# Altium schematic sheet FPGA Transcievers.SchDoc
size A3; SheetNumber: 6; SheetTotal: 16
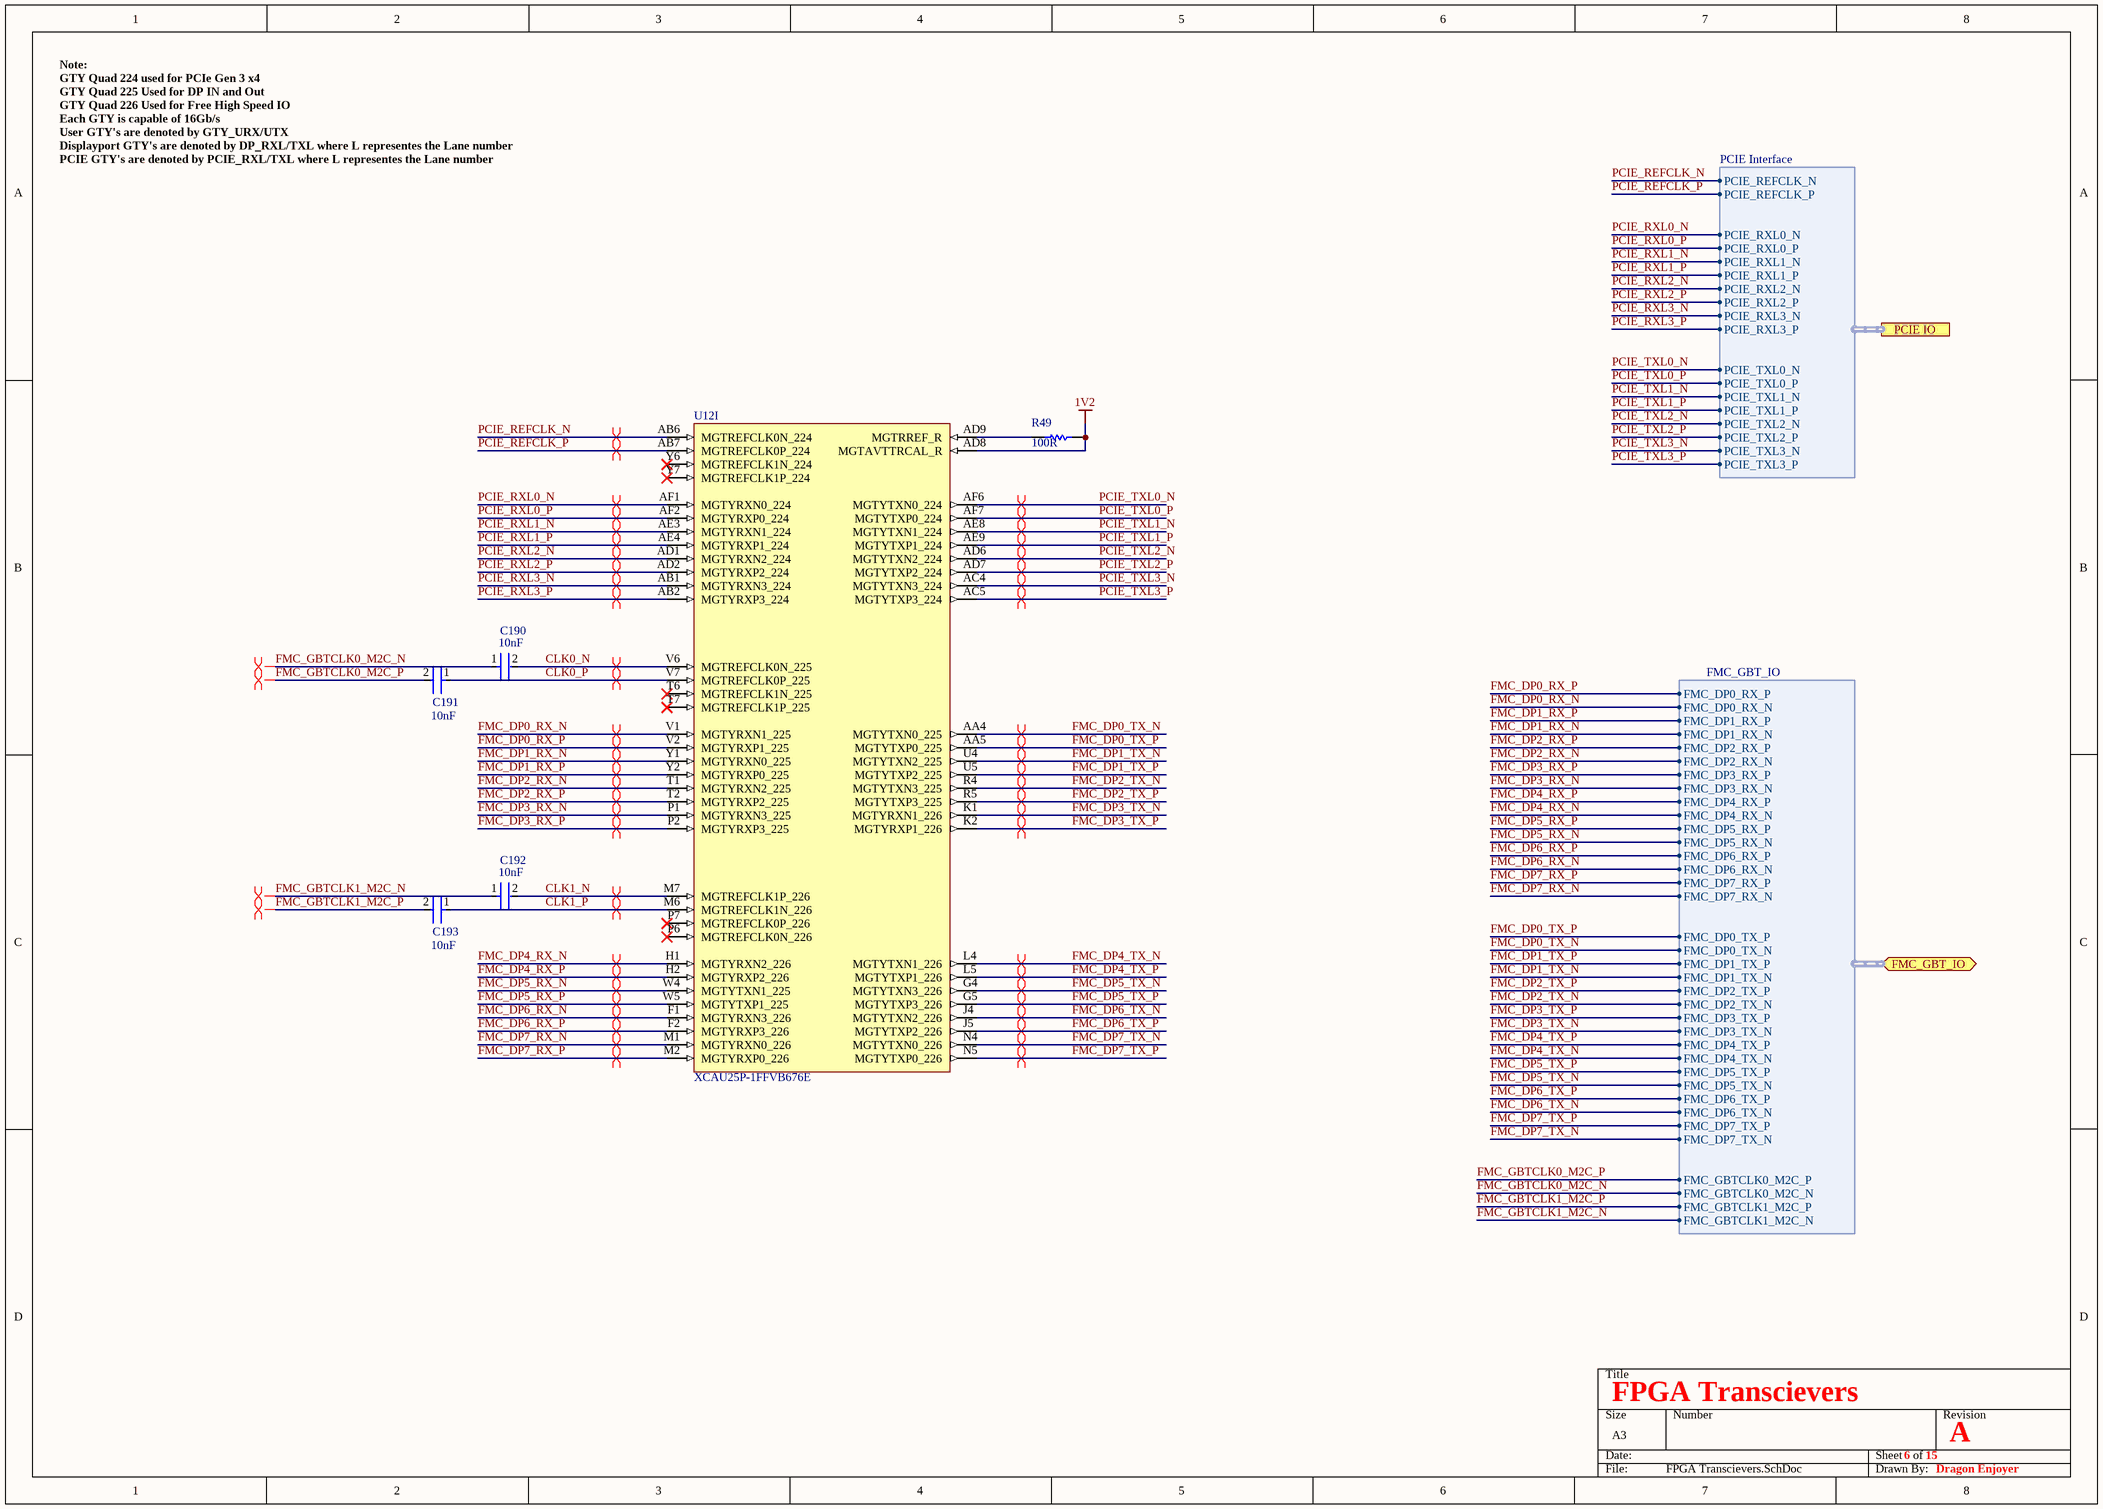
[diagram p0: FPGA Transcievers.SchDoc]

## Parts
C190  Capacitance: 10nF  [FP-GRM155-0_05-IPC_C]  (hidden comment: GRM155R71H103KA88D)
C191  Capacitance: 10nF  [FP-GRM155-0_05-IPC_C]  (hidden comment: GRM155R71H103KA88D)
C192  Capacitance: 10nF  [FP-GRM155-0_05-IPC_C]  (hidden comment: GRM155R71H103KA88D)
C193  Capacitance: 10nF  [FP-GRM155-0_05-IPC_C]  (hidden comment: GRM155R71H103KA88D)
R49  value 100R  [RESC1005X40X25ML05T10]  (hidden comment: RC0402FR-07100RL)
U12  XCAU25P-1FFVB676E  [BGA676C100P26X26_2600X2600X352]  (part I of 14)

## Ports
FMC_GBT_IO (bidir, harness FMC_GBT_IO), PCIE IO (harness PCIE Interface)

## Harnesses
PCIE Interface: PCIE_REFCLK_N, PCIE_REFCLK_P, PCIE_RXL0_N, PCIE_RXL0_P, PCIE_RXL1_N, PCIE_RXL1_P, PCIE_RXL2_N, PCIE_RXL2_P, PCIE_RXL3_N, PCIE_RXL3_P, PCIE_TXL0_N, PCIE_TXL0_P, PCIE_TXL1_N, PCIE_TXL1_P, PCIE_TXL2_N, PCIE_TXL2_P, PCIE_TXL3_N, PCIE_TXL3_P
FMC_GBT_IO: FMC_DP0_RX_P, FMC_DP0_RX_N, FMC_DP1_RX_P, FMC_DP1_RX_N, FMC_DP2_RX_P, FMC_DP2_RX_N, FMC_DP3_RX_P, FMC_DP3_RX_N, FMC_DP4_RX_P, FMC_DP4_RX_N, FMC_DP5_RX_P, FMC_DP5_RX_N, FMC_DP6_RX_P, FMC_DP6_RX_N, FMC_DP7_RX_P, FMC_DP7_RX_N, FMC_DP0_TX_P, FMC_DP0_TX_N, FMC_DP1_TX_P, FMC_DP1_TX_N, FMC_DP2_TX_P, FMC_DP2_TX_N, FMC_DP3_TX_P, FMC_DP3_TX_N, FMC_DP4_TX_P, FMC_DP4_TX_N, FMC_DP5_TX_P, FMC_DP5_TX_N, FMC_DP6_TX_P, FMC_DP6_TX_N, FMC_DP7_TX_P, FMC_DP7_TX_N, FMC_GBTCLK0_M2C_P, FMC_GBTCLK0_M2C_N, FMC_GBTCLK1_M2C_P, FMC_GBTCLK1_M2C_N

## Nets
1V2: R49.2 U12.AD8(MGTAVTTRCAL_R)
CLK0_N: C190.2 U12.V6(MGTREFCLK0N_225)
CLK0_P: C191.1 U12.V7(MGTREFCLK0P_225)
CLK1_N: C192.2 U12.M7(MGTREFCLK1P_226)
CLK1_P: C193.1 U12.M6(MGTREFCLK1N_226)
FMC_DP0_RX_N: U12.V1(MGTYRXN1_225) ; port FMC_GBT_IO.FMC_DP0_RX_N
FMC_DP0_RX_P: U12.V2(MGTYRXP1_225) ; port FMC_GBT_IO.FMC_DP0_RX_P
FMC_DP0_TX_N: U12.AA4(MGTYTXN0_225) ; port FMC_GBT_IO.FMC_DP0_TX_N
FMC_DP0_TX_P: U12.AA5(MGTYTXP0_225) ; port FMC_GBT_IO.FMC_DP0_TX_P
FMC_DP1_RX_N: U12.Y1(MGTYRXN0_225) ; port FMC_GBT_IO.FMC_DP1_RX_N
FMC_DP1_RX_P: U12.Y2(MGTYRXP0_225) ; port FMC_GBT_IO.FMC_DP1_RX_P
FMC_DP1_TX_N: U12.U4(MGTYTXN2_225) ; port FMC_GBT_IO.FMC_DP1_TX_N
FMC_DP1_TX_P: U12.U5(MGTYTXP2_225) ; port FMC_GBT_IO.FMC_DP1_TX_P
FMC_DP2_RX_N: U12.T1(MGTYRXN2_225) ; port FMC_GBT_IO.FMC_DP2_RX_N
FMC_DP2_RX_P: U12.T2(MGTYRXP2_225) ; port FMC_GBT_IO.FMC_DP2_RX_P
FMC_DP2_TX_N: U12.R4(MGTYTXN3_225) ; port FMC_GBT_IO.FMC_DP2_TX_N
FMC_DP2_TX_P: U12.R5(MGTYTXP3_225) ; port FMC_GBT_IO.FMC_DP2_TX_P
FMC_DP3_RX_N: U12.P1(MGTYRXN3_225) ; port FMC_GBT_IO.FMC_DP3_RX_N
FMC_DP3_RX_P: U12.P2(MGTYRXP3_225) ; port FMC_GBT_IO.FMC_DP3_RX_P
FMC_DP3_TX_N: U12.K1(MGTYRXN1_226) ; port FMC_GBT_IO.FMC_DP3_TX_N
FMC_DP3_TX_P: U12.K2(MGTYRXP1_226) ; port FMC_GBT_IO.FMC_DP3_TX_P
FMC_DP4_RX_N: U12.H1(MGTYRXN2_226) ; port FMC_GBT_IO.FMC_DP4_RX_N
FMC_DP4_RX_P: U12.H2(MGTYRXP2_226) ; port FMC_GBT_IO.FMC_DP4_RX_P
FMC_DP4_TX_N: U12.L4(MGTYTXN1_226) ; port FMC_GBT_IO.FMC_DP4_TX_N
FMC_DP4_TX_P: U12.L5(MGTYTXP1_226) ; port FMC_GBT_IO.FMC_DP4_TX_P
FMC_DP5_RX_N: U12.W4(MGTYTXN1_225) ; port FMC_GBT_IO.FMC_DP5_RX_N
FMC_DP5_RX_P: U12.W5(MGTYTXP1_225) ; port FMC_GBT_IO.FMC_DP5_RX_P
FMC_DP5_TX_N: U12.G4(MGTYTXN3_226) ; port FMC_GBT_IO.FMC_DP5_TX_N
FMC_DP5_TX_P: U12.G5(MGTYTXP3_226) ; port FMC_GBT_IO.FMC_DP5_TX_P
FMC_DP6_RX_N: U12.F1(MGTYRXN3_226) ; port FMC_GBT_IO.FMC_DP6_RX_N
FMC_DP6_RX_P: U12.F2(MGTYRXP3_226) ; port FMC_GBT_IO.FMC_DP6_RX_P
FMC_DP6_TX_N: U12.J4(MGTYTXN2_226) ; port FMC_GBT_IO.FMC_DP6_TX_N
FMC_DP6_TX_P: U12.J5(MGTYTXP2_226) ; port FMC_GBT_IO.FMC_DP6_TX_P
FMC_DP7_RX_N: U12.M1(MGTYRXN0_226) ; port FMC_GBT_IO.FMC_DP7_RX_N
FMC_DP7_RX_P: U12.M2(MGTYRXP0_226) ; port FMC_GBT_IO.FMC_DP7_RX_P
FMC_DP7_TX_N: U12.N4(MGTYTXN0_226) ; port FMC_GBT_IO.FMC_DP7_TX_N
FMC_DP7_TX_P: U12.N5(MGTYTXP0_226) ; port FMC_GBT_IO.FMC_DP7_TX_P
FMC_GBTCLK0_M2C_N: C190.1 ; port FMC_GBT_IO.FMC_GBTCLK0_M2C_N
FMC_GBTCLK0_M2C_P: C191.2 ; port FMC_GBT_IO.FMC_GBTCLK0_M2C_P
FMC_GBTCLK1_M2C_N: C192.1 ; port FMC_GBT_IO.FMC_GBTCLK1_M2C_N
FMC_GBTCLK1_M2C_P: C193.2 ; port FMC_GBT_IO.FMC_GBTCLK1_M2C_P
PCIE_REFCLK_N: U12.AB6(MGTREFCLK0N_224) ; port PCIE IO.PCIE_REFCLK_N
PCIE_REFCLK_P: U12.AB7(MGTREFCLK0P_224) ; port PCIE IO.PCIE_REFCLK_P
PCIE_RXL0_N: U12.AF1(MGTYRXN0_224) ; port PCIE IO.PCIE_RXL0_N
PCIE_RXL0_P: U12.AF2(MGTYRXP0_224) ; port PCIE IO.PCIE_RXL0_P
PCIE_RXL1_N: U12.AE3(MGTYRXN1_224) ; port PCIE IO.PCIE_RXL1_N
PCIE_RXL1_P: U12.AE4(MGTYRXP1_224) ; port PCIE IO.PCIE_RXL1_P
PCIE_RXL2_N: U12.AD1(MGTYRXN2_224) ; port PCIE IO.PCIE_RXL2_N
PCIE_RXL2_P: U12.AD2(MGTYRXP2_224) ; port PCIE IO.PCIE_RXL2_P
PCIE_RXL3_N: U12.AB1(MGTYRXN3_224) ; port PCIE IO.PCIE_RXL3_N
PCIE_RXL3_P: U12.AB2(MGTYRXP3_224) ; port PCIE IO.PCIE_RXL3_P
PCIE_TXL0_N: U12.AF6(MGTYTXN0_224) ; port PCIE IO.PCIE_TXL0_N
PCIE_TXL0_P: U12.AF7(MGTYTXP0_224) ; port PCIE IO.PCIE_TXL0_P
PCIE_TXL1_N: U12.AE8(MGTYTXN1_224) ; port PCIE IO.PCIE_TXL1_N
PCIE_TXL1_P: U12.AE9(MGTYTXP1_224) ; port PCIE IO.PCIE_TXL1_P
PCIE_TXL2_N: U12.AD6(MGTYTXN2_224) ; port PCIE IO.PCIE_TXL2_N
PCIE_TXL2_P: U12.AD7(MGTYTXP2_224) ; port PCIE IO.PCIE_TXL2_P
PCIE_TXL3_N: U12.AC4(MGTYTXN3_224) ; port PCIE IO.PCIE_TXL3_N
PCIE_TXL3_P: U12.AC5(MGTYTXP3_224) ; port PCIE IO.PCIE_TXL3_P
NetR49_1: R49.1 U12.AD9(MGTRREF_R)

Not connected (* = marked no-connect by the designer): U12 P6(MGTREFCLK0N_226)* P7(MGTREFCLK0P_226)* T6(MGTREFCLK1N_225)* T7(MGTREFCLK1P_225)* Y6(MGTREFCLK1N_224)* Y7(MGTREFCLK1P_224)*

## Layout directives
differential pair: CLK0_N, CLK0_P, CLK1_N, CLK1_P, FMC_DP0_RX_N, FMC_DP0_RX_P, FMC_DP0_TX_N, FMC_DP0_TX_P, FMC_DP1_RX_N, FMC_DP1_RX_P, FMC_DP1_TX_N, FMC_DP1_TX_P, FMC_DP2_RX_N, FMC_DP2_RX_P, FMC_DP2_TX_N, FMC_DP2_TX_P, FMC_DP3_RX_N, FMC_DP3_RX_P, FMC_DP3_TX_N, FMC_DP3_TX_P, FMC_DP4_RX_N, FMC_DP4_RX_P, FMC_DP4_TX_N, FMC_DP4_TX_P, FMC_DP5_RX_N, FMC_DP5_RX_P, FMC_DP5_TX_N, FMC_DP5_TX_P, FMC_DP6_RX_N, FMC_DP6_RX_P, FMC_DP6_TX_N, FMC_DP6_TX_P, FMC_DP7_RX_N, FMC_DP7_RX_P, FMC_DP7_TX_N, FMC_DP7_TX_P, FMC_GBTCLK0_M2C_N, FMC_GBTCLK0_M2C_P, FMC_GBTCLK1_M2C_N, FMC_GBTCLK1_M2C_P, PCIE_REFCLK_N, PCIE_REFCLK_P, PCIE_RXL0_N, PCIE_RXL0_P, PCIE_RXL1_N, PCIE_RXL1_P, PCIE_RXL2_N, PCIE_RXL2_P, PCIE_RXL3_N, PCIE_RXL3_P, PCIE_TXL0_N, PCIE_TXL0_P, PCIE_TXL1_N, PCIE_TXL1_P, PCIE_TXL2_N, PCIE_TXL2_P, PCIE_TXL3_N, PCIE_TXL3_P

## Notes on the sheet
- Note:
- GTY Quad 224 used for PCIe Gen 3 x4
- GTY Quad 225 Used for DP IN and Out
- GTY Quad 226 Used for Free High Speed IO
- Each GTY is capable of 16Gb/s
- User GTY's are denoted by GTY_URX/UTX
- Displayport GTY's are denoted by DP_RXL/TXL where L representes the Lane number
- PCIE GTY's are denoted by PCIE_RXL/TXL where L representes the Lane number
- FPGA Transcievers
- 6
- 15
- A
- Dragon Enjoyer

## Library data of the parts
C190-C193 = CMP-2008-04637-5: Chip Multilayer Ceramic Capacitors for General Purpose, 0402, 10000pF, X7R, 15%, 10%, 50V; Voltage: 25V; Tolerance: 10%; Mount: Surface Mount; Lead Free: Lead Free; Radiation Hardening: No; Case Code (Imperial): 0402; REACH SVHC: No SVHC; Case/Package: 0402; Dielectric: X7R; Voltage Rating (DC): 50V; Max Operating Temperature: 125°C; Termination: SMD/SMT; Material: Ceramic; Width: 0.02inch; Package Quantity: 1; Voltage Rating: 50V; Thickness: 0.022inch; Packaging: Tape and Reel; Height: 0.5mm; Number of Pins: 2; Case Code (Metric): 1005; Min Operating Temperature: -55°C; Length: 1mm; Depth: 0.5mm
R49 = CMP-2002-07344-1: Manufacturer: Yageo / Phycomp; Part Number: RC0402FR-07100RL
U12 = CMP-020-00023-3: FPGA XCAU25 Family 308437 Logic Units 308437 Cells 0.85V 676-Pin FCBGA